# EAGLE design power_switch (EAGLE 9.0.1)
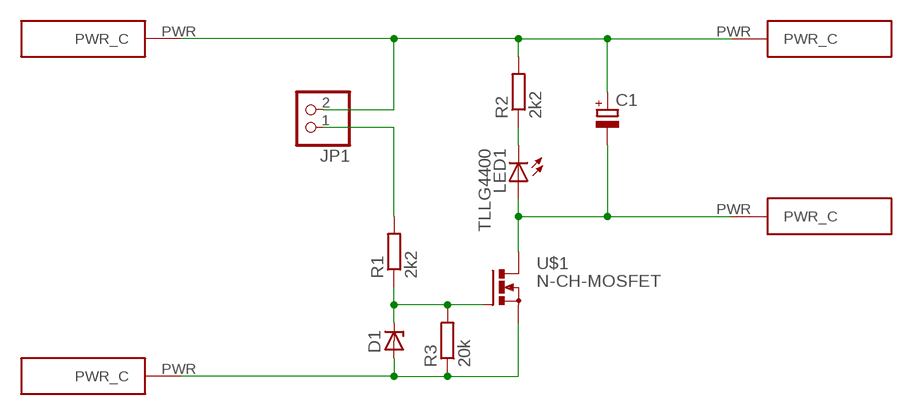
[diagram p0: schematic, sheet 1]

## Parts
C1  CPOL-EUE7.5-16  [E7,5-16]
D1  ZENER-DIODEDO41Z10  [DO41Z10]
JP1  PINHD-1X2  [1X02]
LED1  TLLG4400  [LED3MM]
R1  2k2  R-EU_0204/7  [0204/7]
R2  2k2  R-EU_0204/7  [0204/7]
R3  20k  R-EU_0204/7  [0204/7]
U$1  N-CH-MOSFET  [TO220BV]
U$2  24V  POWERCONNECTOR  [SMD_PAD]
U$3  POWERCONNECTOR  [SMD_PAD]
U$4  POWERCONNECTOR  [SMD_PAD]
U$5  POWERCONNECTOR  [SMD_PAD]

## Nets
N$1: D1.C R1.1 R3.2 U$1.G
N$2: D1.A R3.1 U$1.S U$3.PWR(PWR_C)
N$3: C1.- LED1.A U$1.D U$5.PWR(PWR_C)
N$4: LED1.K(C) R2.1
N$5: C1.+ JP1.2 R2.2 U$2.PWR(PWR_C) U$4.PWR(PWR_C)
N$6: JP1.1 R1.2

## Library data of the parts
C1 = resistor:CPOL-EU: POLARIZED CAPACITOR, European symbol
D1 = diode:ZENER-DIODE: Z-Diode
JP1 = pinhead:PINHD-1X2: PIN HEADER
LED1 = led:TLLG4400: Low Current (2mA) LED 3 mm Tinted Diffused Package color GREEN Source: Data sheet <http://www.farnell.com/datasheets/391098.pdf>; MF: VISHAY SEMICONDUCTOR; OC_FARNELL: 1612435
R1-R3 = resistor:R-EU_: RESISTOR, European symbol
U$1 = resistors:N-CH-MOSFET
U$2-U$5 = PWR_C:POWERCONNECTOR

## Board
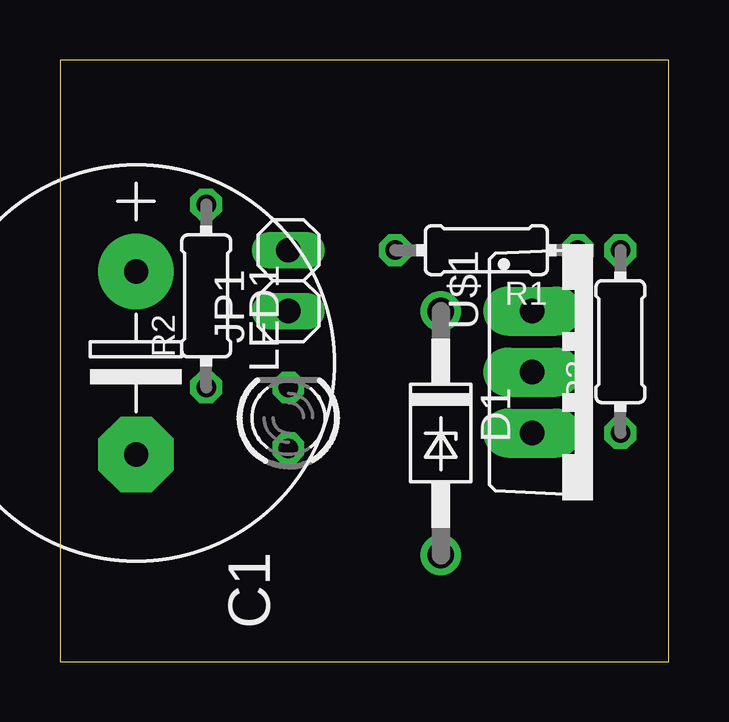
[diagram p1: board, top side]
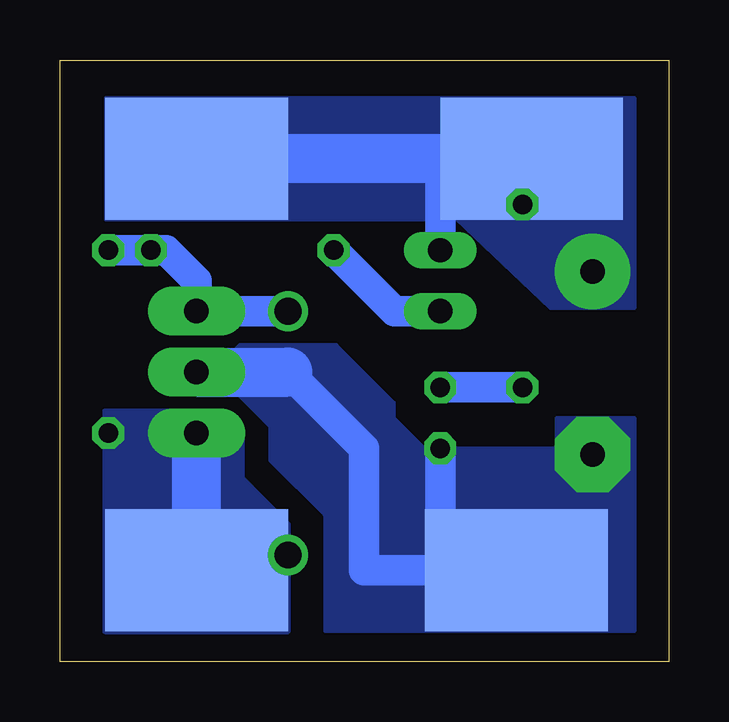
[diagram p2: board, bottom side, seen from below]

Size 25.38 x 25.07 mm. Coordinates in mm from the lower left corner, seen from the top.
Outline: 0,0 25.38,0 25.38,25.07 0,25.07 0,0
Copper layers (1*16): Top 0.035mm / dielectric 1.5mm / Bottom 0.035mm
Design rules "default": minimum track width 6mil, minimum drill 0.35mm, track to track 6mil, track to pad 6mil, pad to pad 6mil, via to via 6mil, smd to smd 6mil, copper to edge 40mil, drill to drill 6mil, minimum pad ring 10mil, minimum via ring 8mil, stop-mask expansion 4mil, vias tented up to drill 0mil, thermal gap 10mil

### Footprints (pad centres in the part's own frame; a part is rotated, then mirrored left to right if it is on the bottom)
E7,5-16 = drill 1.016 pad 3.15: + -3.81,0 | drill 1.016 pad 3.15 octagon: - 3.81,0
DO41Z10 = drill 1.118: A 5.08,0; C -5.08,0
1X02 = drill 1.016 long: 1 -1.27,0; 2 1.27,0
LED3MM = drill 0.813 octagon: A -1.27,0; K 1.27,0
0204/7 = drill 0.813 octagon: 1 -3.81,0; 2 3.81,0
TO220BV = drill 1.016 pad 2.032 long: D 0,-2.54; G -2.54,-2.54; S 2.54,-2.54
SMD_PAD = smd 7.62 x 5.08: PWR 0,0

### Placement (x,y rotation side)
C1  3.17,12.45 270 top
D1  15.88,9.53 270 top
JP1  9.53,15.88 90 top
LED1  9.53,10.16 90 top
R1  17.78,17.14 180 top
R2  6.1,15.24 90 top
R3  23.37,13.34 90 top
U$1  22.23,12.06 270 top
U$2  5.71,20.95 0 bottom
U$3  19.68,3.81 0 bottom
U$4  19.68,20.95 0 bottom
U$5  6.35,3.81 0 bottom

### Tracks (layer width: path | path; a pad name or v marks a point on that pad's centre or on a via)
N$1
  Bottom 1.27: D1.C U$1.G 19.68,15.88 20.95,17.14 R1.1 R3.2
N$2
  Bottom 2.032: U$3.PWR U$1.S
  pour Bottom (no thermals): 17.78,9.53 19.68,10.41 23.5,10.41 23.5,1.27 15.88,1.27 15.88,5.71 17.78,7.62
N$3
  Bottom 1.27: 15.88,12.06 12.7,8.89 12.7,3.81 9.53,3.81 | 9.53,3.81 U$5.PWR | LED1.A 9.53,3.81
  Bottom 2.032: U$1.D 15.88,12.06
  pour Bottom (no thermals): 2.54,8.89 10.16,8.89 11.43,10.16 11.43,10.79 13.84,13.21 17.91,13.21 18.03,13.08 18.03,11.18 16.64,9.78 16.64,8.38 14.35,6.1 14.35,1.27 2.54,1.27
  pour Bottom (no thermals): 1.4,10.16 4.7,10.16 4.7,8.89 7.24,6.35 7.24,1.27 1.4,1.27
N$4
  Bottom 1.27: R2.1 LED1.K
N$5
  Bottom 1.27: JP1.2 9.53,20.95 | R2.2 6.1,20.57 U$2.PWR
  Bottom 2.032: U$2.PWR 9.53,20.95 U$4.PWR
  pour Bottom (no thermals): 9.65,19.18 4.95,14.73 1.4,14.73 1.4,23.5 7.11,23.5
  pour Bottom (no thermals): 1.4,23.5 23.5,23.5 23.5,18.41 1.4,18.41
N$6
  Bottom 1.27: R1.2 11.43,14.61 JP1.1